# EAGLE design ADMP401-CMS1206 (EAGLE 8.0.1)
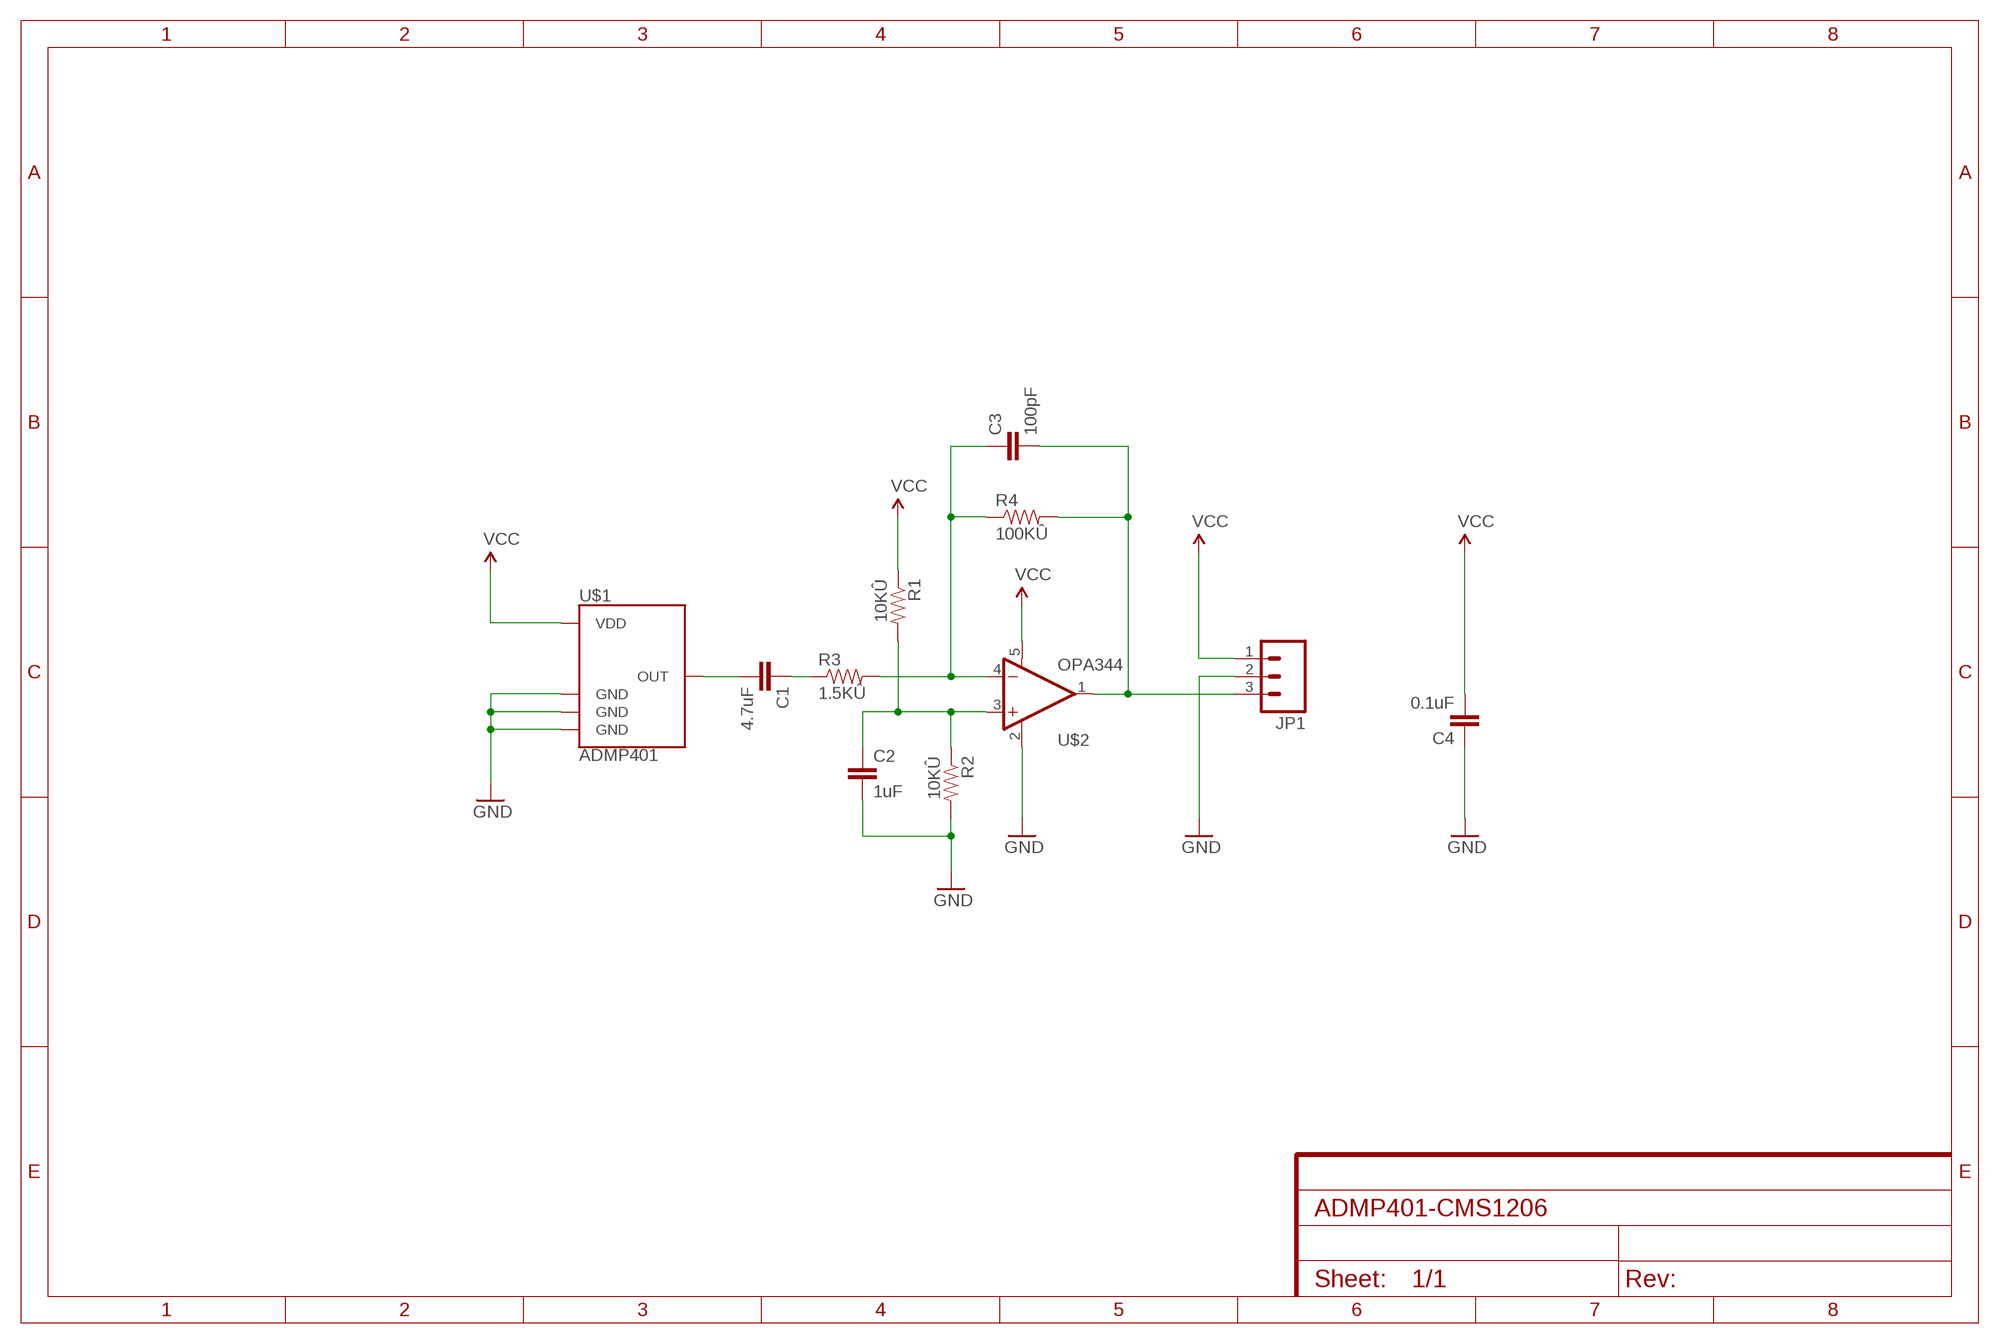
[diagram p0: schematic, sheet 1]

## Parts
C1  4.7uF  CAP1206  [1206]
C2  1uF  CAP1206  [1206]
C3  100pF  CAP1206  [1206]
C4  0.1uF  CAP1206  [1206]
JP1  M03PTH  [1X03]
R1  10KÛ  RESISTOR1206  [1206]
R2  10KÛ  RESISTOR1206  [1206]
R3  1.5KÛ  RESISTOR1206  [1206]
R4  100KÛ  RESISTOR1206  [1206]
U$1  ADMP401  [ADMP401]
U$2  OPA344  [SOT23-5]

## Nets
GND: C2.2 C4.1 JP1.2 R2.2 U$1.2(GND) U$1.4(GND) U$1.6(GND) U$2.2(V-)
N$1: C1.2 U$1.1(OUT)
N$2: C1.1 R3.1
N$3: C3.1 R3.2 R4.1 U$2.4(-IN)
N$4: C3.2 JP1.3 R4.2 U$2.1(OUT)
N$5: C2.1 R1.2 R2.1 U$2.3(+IN)
VCC: C4.2 JP1.1 R1.1 U$1.5(VDD) U$2.5(V+)

## Library data of the parts
C1-C4 = SparkFun-Capacitors:CAP: Capacitor Standard 0603 ceramic capacitor, and 0.1" leaded capacitor.
JP1 = SparkFun-Connectors:M03: Header 3 Standard 3-pin 0.1" header. Use with straight break away headers (SKU : PRT-00116), right angle break away headers (PRT-00553), swiss pins (PRT-00743), machine pins (PRT-00117), and female headers (PRT-00115). Molex polarized connector foot print use with SKU : PRT-08232 with associated crimp pins and housings.
R1-R4 = SparkFun-Resistors:RESISTOR: Resistor Basic schematic elements and footprints for 0603, 1206, and PTH resistors.
U$1 = SparkFun-Sensors:ADMP401: Omnidirection bottom-port MEMS microphone
U$2 = SparkFun-AnalogIC:OPA344: Single gate rail-to-rail output op-amp. Inputs extend 300mV past rails.

## Board
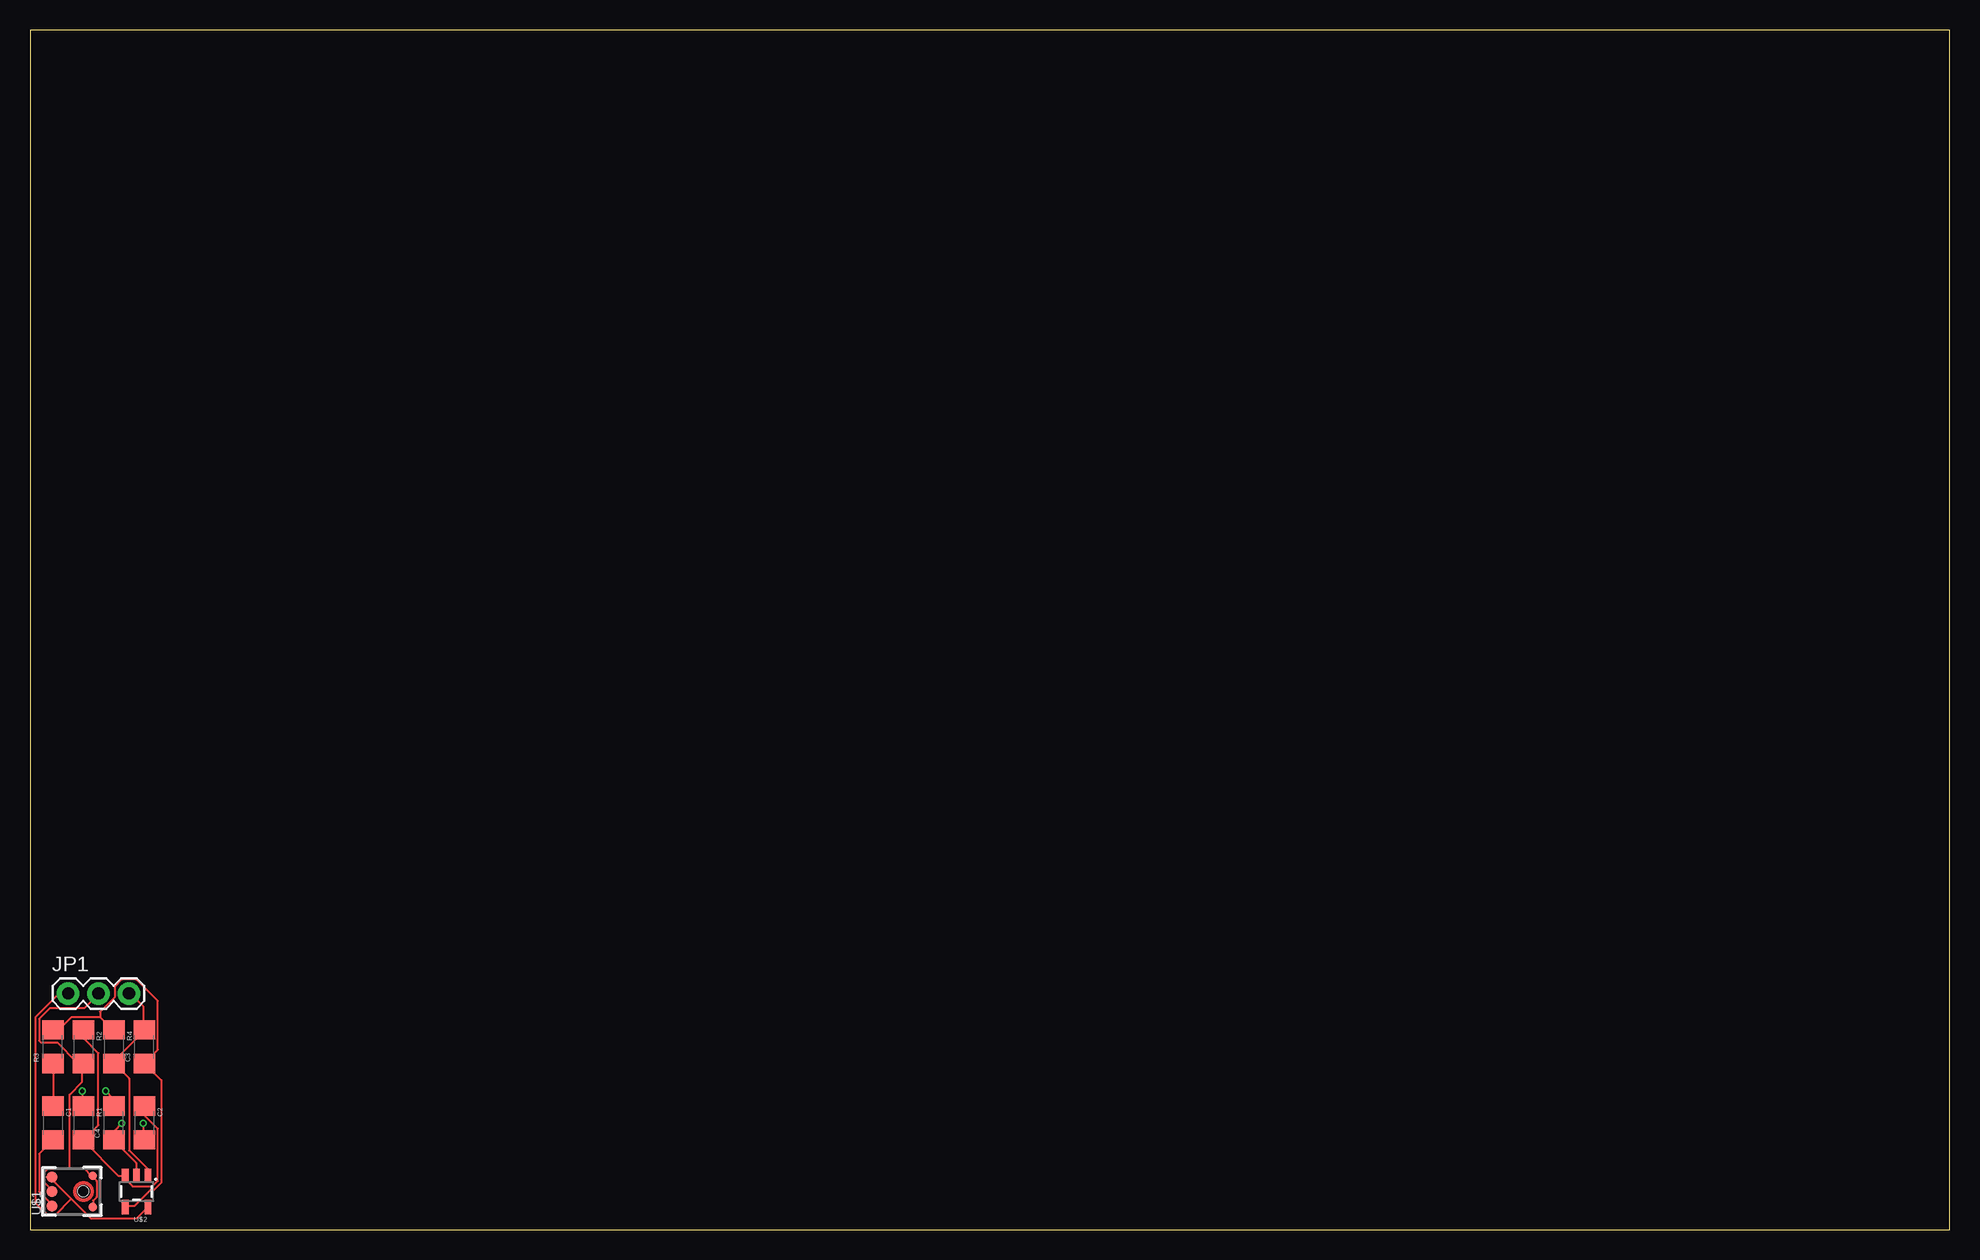
[diagram p1: board, top side]
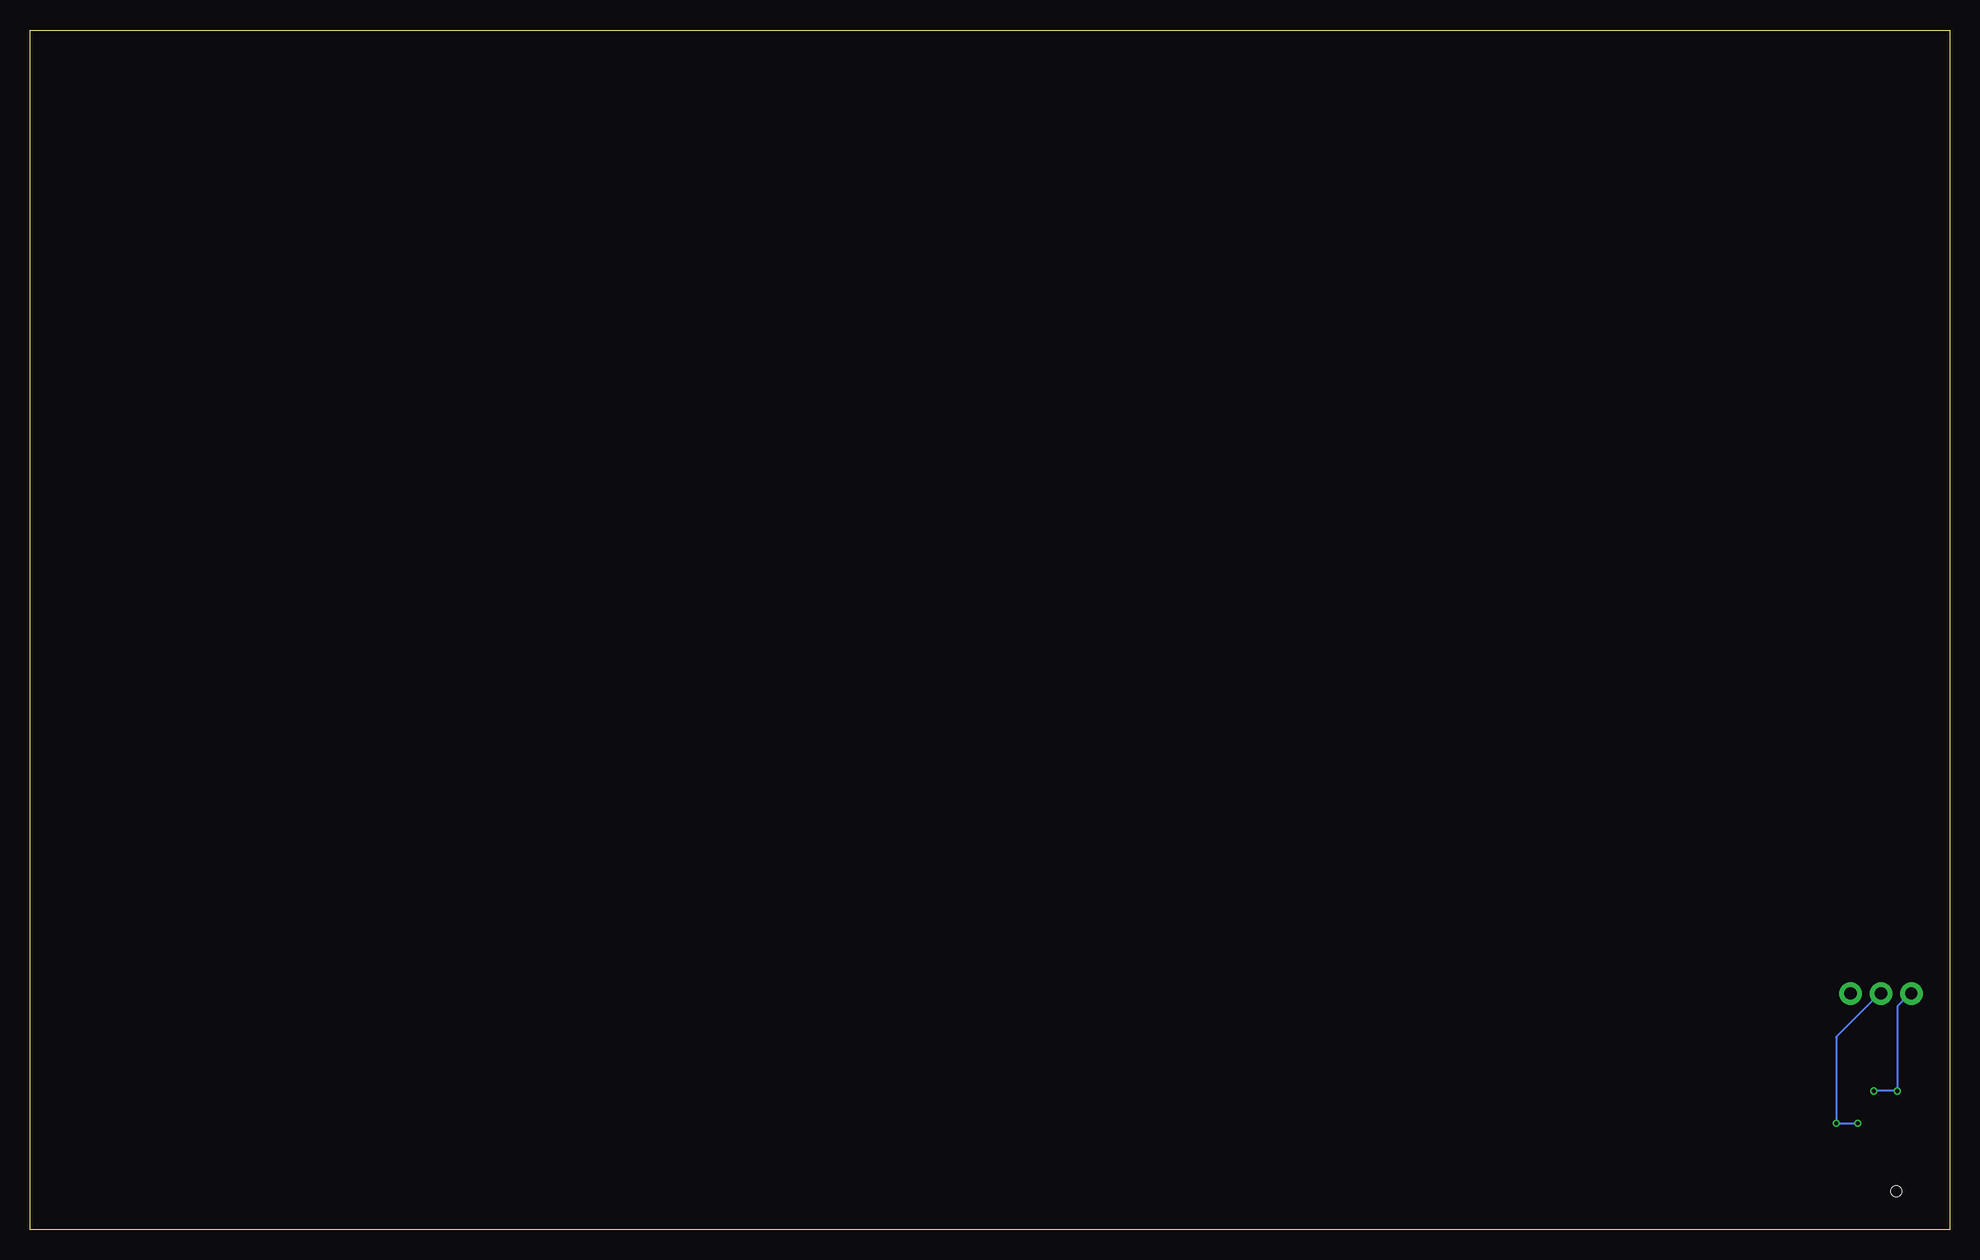
[diagram p2: board, bottom side, seen from below]

Size 160 x 100 mm. Coordinates in mm from the lower left corner, seen from the top.
Outline: 0,0 160,0 160,100 0,100 0,0
Copper layers (1+2*3+16): Top 0.018mm / dielectric 0.36mm / Route2 0.035mm / dielectric 0.71mm / Route3 0.035mm / dielectric 0.36mm / Bottom 0.018mm
Design rules "eC_4Layer_PClass6_BaseCopperO18-I35_eCDefault": minimum track width 0.15mm, minimum drill 0.35mm, track to track 0.15mm, track to pad 0.15mm, pad to pad 0.15mm, via to via 0.15mm, smd to smd 0mil, copper to edge 0.25mm, drill to drill 0.35mm, minimum pad ring 0.175mm, minimum via ring 0.125mm, stop-mask expansion 0mil, vias tented up to drill 0.45mm, thermal gap 0.2mm

### Footprints (pad centres in the part's own frame; a part is rotated, then mirrored left to right if it is on the bottom)
1206 = smd 1.6 x 1.8: 1 -1.4,0; 2 1.4,0
1X03 = drill 1.016 pad 1.88: 1 0,0; 2 2.54,0; 3 5.08,0
ADMP401 = smd 0.9 x 0.9: 1 -1.2,2.62; 5 1.2,2.62; 6 0,2.62 | smd 0.7 x 0.7: 2 1.3,-0.8; 4 -1.3,-0.8 | hole 0.9: 0,0
SOT23-5 = smd 0.55 x 1.2: 1 -0.95,-1.3; 2 0,-1.3; 3 0.95,-1.3; 4 0.95,1.3; 5 -0.95,1.3

### Placement (x,y rotation side)
C1  1.91,8.89 270 top
C2  9.53,8.89 270 top
C3  9.53,15.24 90 top
C4  6.99,8.89 90 top
JP1  3.17,19.68 0 top
R1  4.45,8.89 270 top
R2  4.45,15.24 270 top
R3  1.91,15.24 90 top
R4  6.99,15.24 270 top
U$1  4.45,3.17 90 top
U$2  8.89,3.17 180 top

### Tracks (layer width: path | path; a pad name or v marks a point on that pad's centre or on a via)
GND  (via drill 0.35)
  Top 0.15: U$1.4 5.25,1.95 5.25,2.4 5.55,2.7 5.55,4.05 5.25,4.35 U$1.2 5.1,4.5 4.5,5.1 3.3,5.1 | 3.3,5.1 1.5,5.1 1.05,4.65 1.05,4.05 1.8,3.3 U$1.6 | 3.3,5.1 3.3,11.25 4.35,12.3 4.35,13.8 R2.2 4.35,13.95 3.9,13.95 2.25,15.6 0.9,15.6 0.75,15.75 0.75,17.55 1.65,18.45 4.5,18.45 5.7,19.65 JP1.2 | U$2.2 8.85,4.5 8.85,5.55 7.05,7.35 C4.1 7.05,7.5 7.05,8.25 v7.65,8.85 | v9.45,8.85 9.45,7.5 C2.2
  Bottom 0.15: JP1.2 5.85,19.65 9.45,16.05 v9.45,8.85 v7.65,8.85
N$1
  Top 0.15: U$1.1 1.8,2.1 0.75,3.15 0.75,6.3 1.8,7.35 C1.2
N$2
  Top 0.15: C1.1 1.95,10.35 1.95,13.8 R3.1
N$3
  Top 0.15: 5.85,17.7 3.45,17.7 2.4,16.65 1.95,16.65 R3.2 | 5.85,17.7 6.9,16.65 R4.1 | U$2.4 7.95,1.95 8.7,1.95 10.05,3.3 10.35,3.3 10.95,3.9 10.95,12.45 9.6,13.8 C3.1 9.6,13.95 10.65,15 10.65,19.05 8.85,20.85 7.65,20.85 7.05,20.25 7.05,19.35 5.85,18.15 5.85,17.7
N$4
  Top 0.15: JP1.3 8.4,19.65 9.45,18.6 9.45,16.65 C3.2 9.45,16.5 6.9,13.95 R4.2 7.05,13.8 8.25,12.6 8.25,6.6 9.75,5.1 9.75,4.5 U$2.1
N$5
  Top 0.15: R2.1 4.5,16.5 4.5,15.9 5.7,14.7 5.7,8.7 4.5,7.5 R1.2 4.5,7.35 7.35,4.5 7.8,4.5 U$2.3 7.8,4.35 8.55,3.6 10.2,3.6 10.65,4.05 10.65,8.4 9.6,9.45 9.6,10.2 C2.1
VCC  (via drill 0.35)
  Top 0.15: 3.45,2.55 5.1,0.9 8.85,0.9 9.75,1.8 U$2.5 | 3.45,2.55 1.95,4.05 1.95,4.35 U$1.5 | v4.35,11.55 4.35,10.35 R1.1 | v6.3,11.55 6.9,10.95 6.9,10.35 C4.2 | 3.45,2.55 2.1,1.2 1.5,1.2 0.45,2.25 0.45,17.7 2.4,19.65 3.15,19.65 JP1.1
  Bottom 0.15: JP1.1 3.3,19.65 4.35,18.6 v4.35,11.55 v6.3,11.55